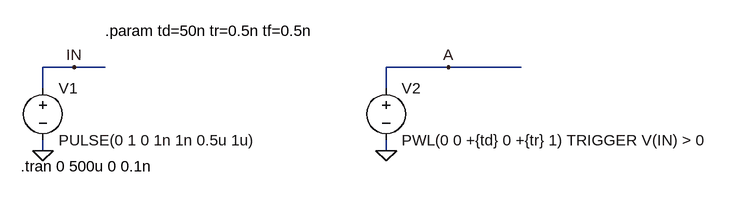
[diagram p0: schematic Single PWL Source.asc]
Single PWL Source.asc, the LTspice schematic file:
Version 4
SHEET 1 1272 680
WIRE 64 -96 16 -96
WIRE 112 -96 64 -96
WIRE 640 -96 544 -96
WIRE 752 -96 640 -96
WIRE 16 -64 16 -96
WIRE 544 -64 544 -96
WIRE 16 32 16 16
WIRE 544 32 544 16
FLAG 16 32 0
FLAG 544 32 0
FLAG 640 -96 A
FLAG 64 -96 IN
SYMBOL voltage 16 -80 R0
WINDOW 123 0 0 Left 0
WINDOW 39 0 0 Left 0
SYMATTR InstName V1
SYMATTR Value PULSE(0 1 0 1n 1n 0.5u 1u)
SYMBOL voltage 544 -80 R0
WINDOW 123 0 0 Left 0
WINDOW 39 0 0 Left 0
SYMATTR InstName V2
SYMATTR Value PWL(0 0 +{td} 0 +{tr} 1) TRIGGER V(IN) > 0
TEXT -18 56 Left 2 !.tran 0 500u 0 0.1n
TEXT 112 -152 Left 2 !.param td=50n tr=0.5n tf=0.5n

The netlist it stands for:
* Single PWL Source.asc
V1 IN 0 PULSE(0 1 0 1n 1n 0.5u 1u)
V2 A 0 PWL(0 0 +{td} 0 +{tr} 1) TRIGGER V(IN) > 0
.tran 0 500u 0 0.1n
.param td=50n tr=0.5n tf=0.5n
.backanno
.end